# Altium schematic sheet POT.SchDoc
size A
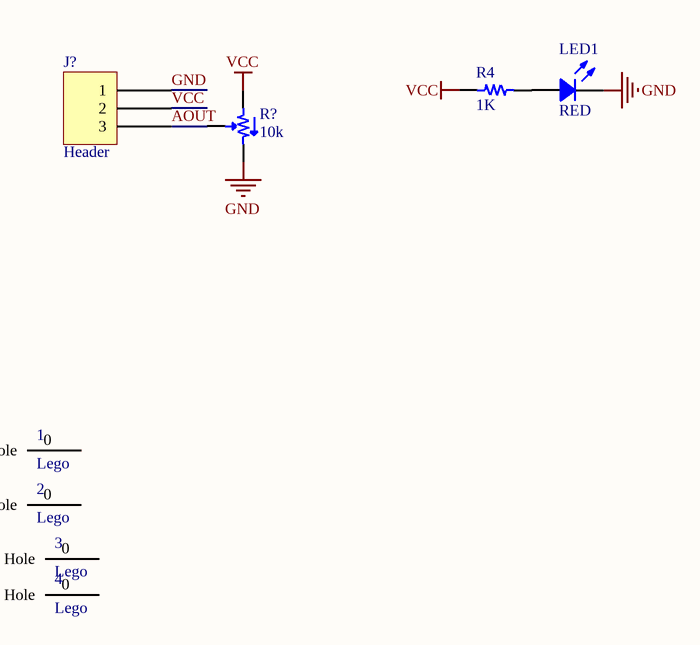
[diagram p0: POT.SchDoc]

## Parts
1  Lego  [Lego Hole]
2  Lego  [Lego Hole]
3  Lego  [Lego Hole]
4  Lego  [Lego Hole]
J?  Header  [JST XH B3B-XH-A - RIGHT]
LED1  RED  [LED 1206/3216 RED]
R4  1K  [RES 1206/3216]
R?  10k  [Setpoint POT]

## Nets
GND: J?.1 LED1.2 R?.3
VCC: J?.2 R4.2 R?.1
AOUT: J?.3 R?.2
NetLED1_1: LED1.1 R4.1

Not connected (* = marked no-connect by the designer): 1 0(Lego_Hole); 2 0(Lego_Hole); 3 0(Lego_Hole); 4 0(Lego_Hole)

## Library data of the parts
J? = 3 Pin
LED1 = LED: Chip LED; Value: Green
R4 = Resistor: SMT Resistor; Value: 1K
R? = Potentiometer: Value: 10k